# Altium project BMS_BQ76PL455.PrjPcb
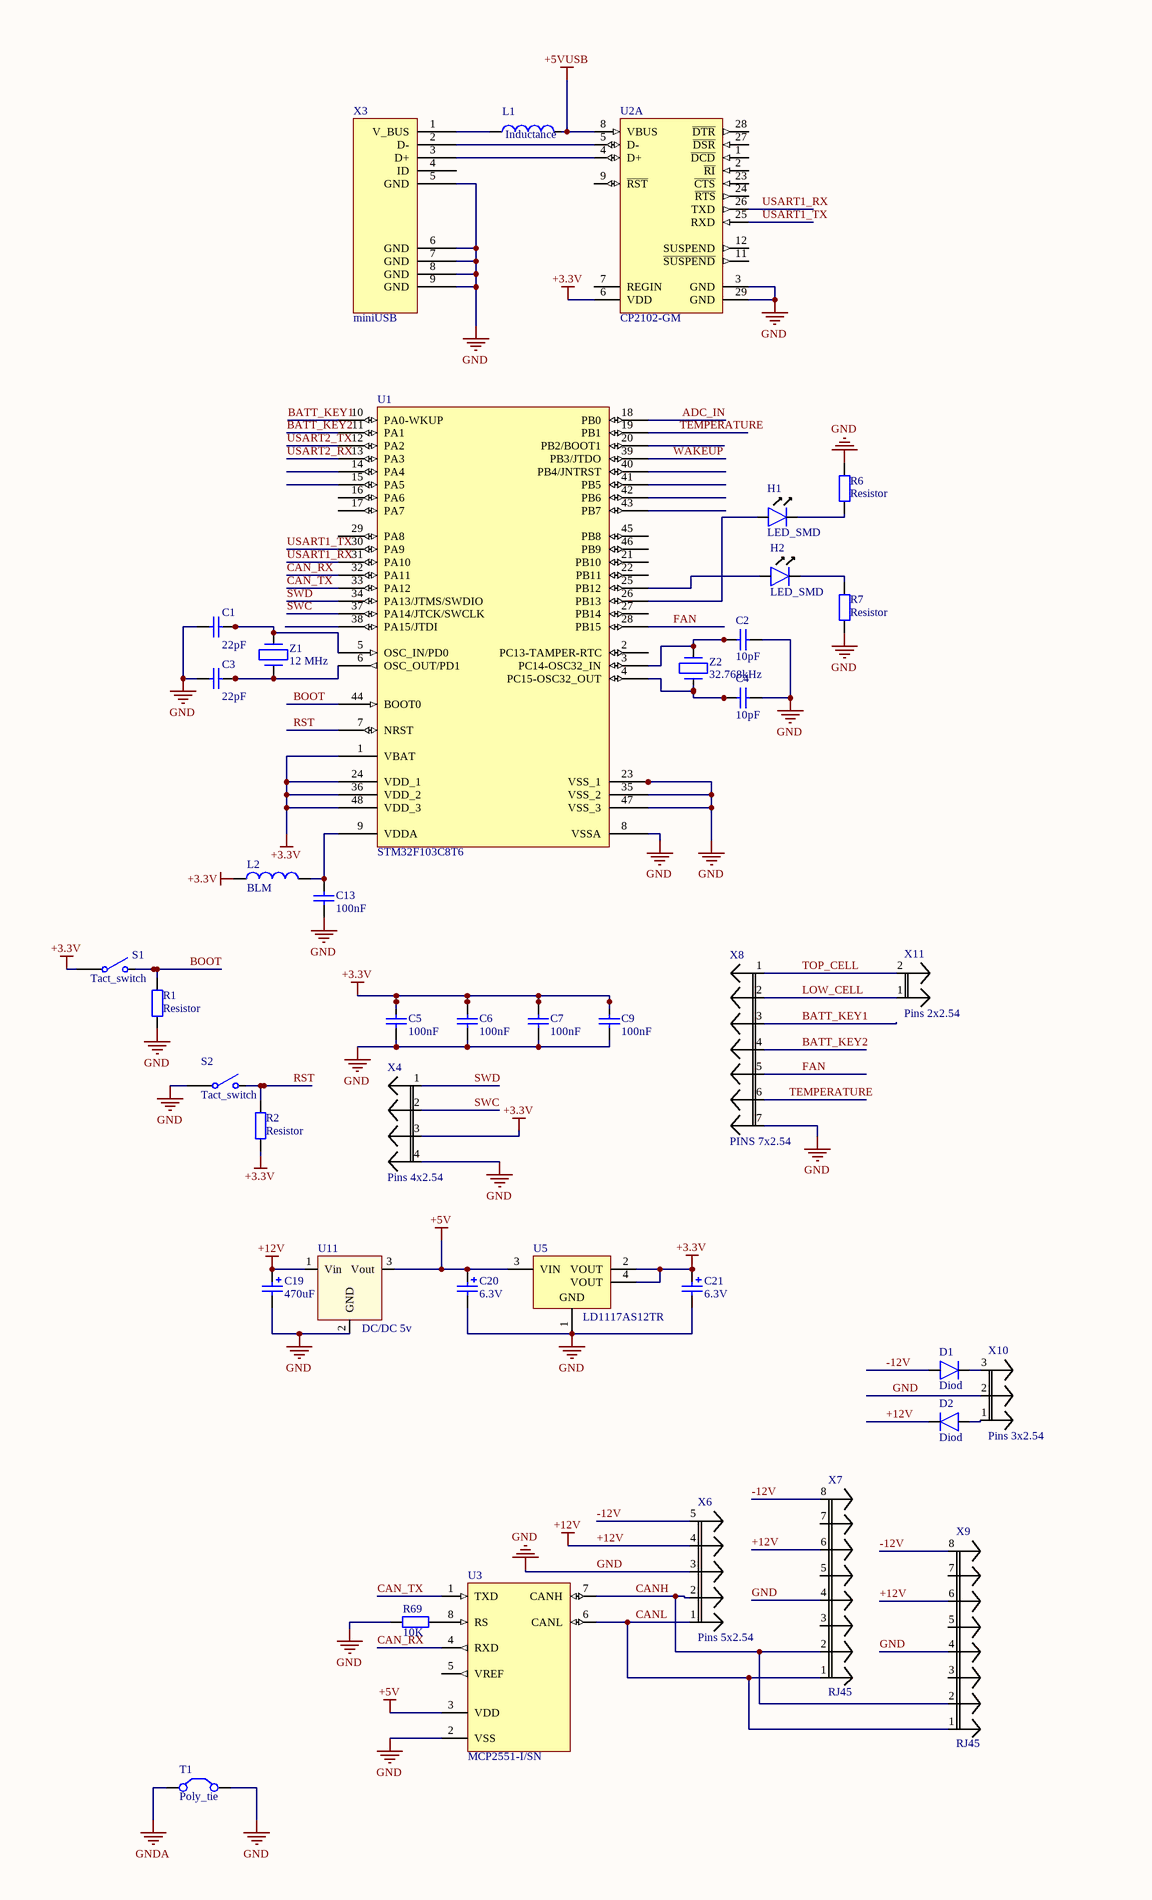
[diagram p0: BMS_BQ76PL455.SchDoc, left]
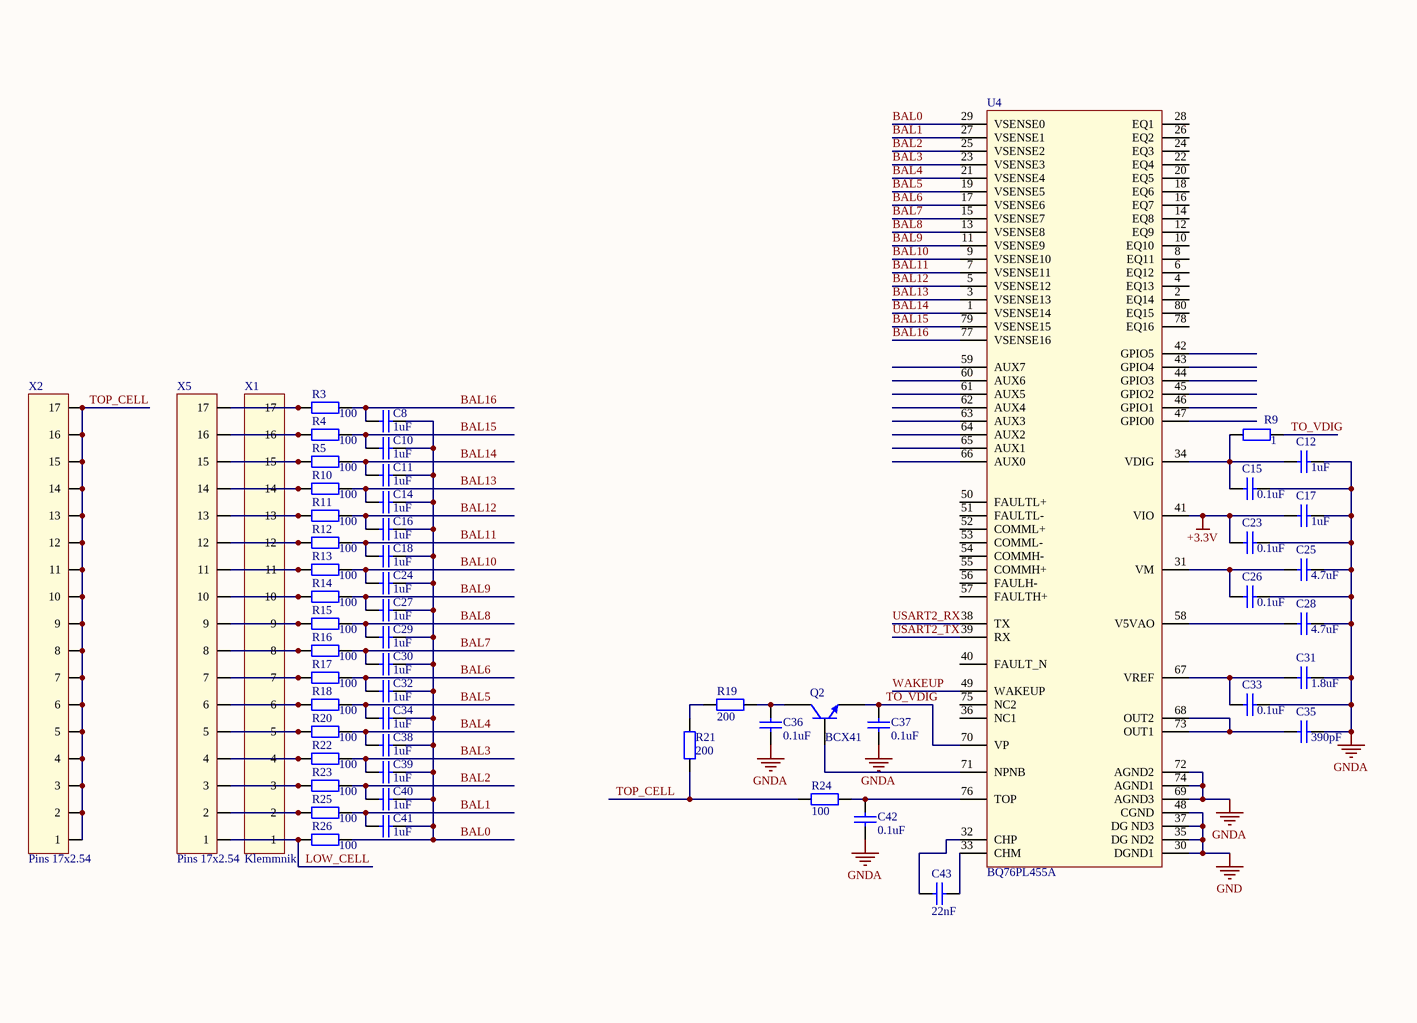
[diagram p1: BMS_BQ76PL455.SchDoc, right]
1 sheet, 97 parts. Net scope: global (net labels, ports and power ports of the same name join across sheets).
Board file: BMS_BQ76PL455.PcbDoc

## Sheet BMS_BQ76PL455.SchDoc
size A1

### Parts
C1  22pF  [C0805]
C2  10pF  [C0805]
C3  22pF  [C0805]
C4  10pF  [C0805]
C5  100nF  [C0805]
C6  100nF  [C0805]
C7  100nF  [C0805]
C8  1uF  [C0805]
C9  100nF  [C0805]
C10  1uF  [C0805]
C11  1uF  [C0805]
C12  1uF  [C0805]
C13  100nF  [C0805]
C14  1uF  [C0805]
C15  0.1uF  [C0805]
C16  1uF  [C0805]
C17  1uF  [C0805]
C18  1uF  [C0805]
C19  470uF  [Cap_El_SMD_10mm]
C20  6.3V  [CAP_EL_SMD_6.3mm]
C21  6.3V  [CAP_EL_SMD_6.3mm]
C23  0.1uF  [C0805]
C24  1uF  [C0805]
C25  4.7uF  [C0805]
C26  0.1uF  [C0805]
C27  1uF  [C0805]
C28  4.7uF  [C0805]
C29  1uF  [C0805]
C30  1uF  [C0805]
C31  1.8uF  [C0805]
C32  1uF  [C0805]
C33  0.1uF  [C0805]
C34  1uF  [C0805]
C35  390pF  [C0805]
C36  0.1uF  [C0805]
C37  0.1uF  [C0805]
C38  1uF  [C0805]
C39  1uF  [C0805]
C40  1uF  [C0805]
C41  1uF  [C0805]
C42  0.1uF  [C0805]
C43  22nF  [C0805]
D1  Diod  [SMB_DIODE]
D2  Diod  [SMB_DIODE]
H1  LED_SMD  [C0805]
H2  LED_SMD  [C0805]
L1  Inductance  [L0805]
L2  BLM  [L0805]
Q2  BCX41  [SOT-23A_N]
R1  Resistor  [R0805]
R2  Resistor  [R0805]
R3  100  [R0805]
R4  100  [R0805]
R5  100  [R0805]
R6  Resistor  [R0805]
R7  Resistor  [R0805]
R9  1  [R0805]
R10  100  [R0805]
R11  100  [R0805]
R12  100  [R0805]
R13  100  [R0805]
R14  100  [R0805]
R15  100  [R0805]
R16  100  [R0805]
R17  100  [R0805]
R18  100  [R0805]
R19  200  [R0805]
R20  100  [R0805]
R21  200  [R0805]
R22  100  [R0805]
R23  100  [R0805]
R24  100  [R0805]
R25  100  [R0805]
R26  100  [R0805]
R69  10K  [R0805]
S1  Tact_switch  [Tact_switch_smd]
S2  Tact_switch  [Tact_switch_smd]
T1  Poly_tie  [POLY_TIE_1x2]
U1  STM32F103C8T6  [LQFP48_N]
U2  CP2102-GM  [SLAB-QFN-28-3125x3125TP_N]  (part A of 2)
U3  MCP2551-I/SN  [SOIC-SN8_N]
U4  BQ76PL455A  [TQFP80 50P1400X1400X120-80N]
U5  LD1117AS12TR  [SOT-223_N]
U11  DC/DC 5v  [DC/DC R-78E]
X1  Klemmnik  [Klemm 17]
X2  Pins 17x2.54  [Pins 17x2 2.54]
X3  miniUSB  [miniUSB]
X4  Pins 4x2.54  [Pins 4x2.54]
X5  Pins 17x2.54  [Pins 17x2 2.54]
X6  Pins 5x2.54  [Pins 5x2.54]
X7  RJ45  [RJ45]
X8  PINS 7x2.54  [PINS 7X2.54]
X9  RJ45  [RJ45]
X10  Pins 3x2.54  [Pins 3x2.54]
X11  Pins 2x2.54  [Pins 2x2.54]
Z1  12 MHz  [kx 13 12MHz]
Z2  32.768kHz  [Geyer KX - 327S 32.768kHz]

### Nets
+3.3V: C5.2 C6.2 C7.2 C9.2 C17.1 C21.1 C23.1 L2.1 R2.1 S1.1(COMMON) U1.1(VBAT) U1.24(VDD_1) U1.36(VDD_2) U1.48(VDD_3) U2.6(VDD) U4.41(VIO) U5.2(VOUT) U5.4(VOUT) X4.3
+5V: C20.1 U3.3(VDD) U5.3(VIN) U11.3(Vout)
+5VUSB: L1.2 U2.8(VBUS)
+12V: C19.1 D2.2 U11.1(Vin) X6.4 X7.6 X9.6
GND: C1.1 C2.1 C3.1 C4.1 C5.1 C6.1 C7.1 C9.1 C13.1 C19.2 C20.2 C21.2 R1.1 R6.2 R7.1 R69.2 S2.1(COMMON) T1.2(C2) U1.8(VSSA) U1.23(VSS_1) U1.35(VSS_2) U1.47(VSS_3) U2.3(GND) U2.29(GND) U3.2(VSS) U4.30(DGND1) U4.35(DG_ND2) U4.37(DG_ND3) U4.48(CGND) U5.1(GND) U11.2(GND) X3.5(GND) X3.6(GND) X3.7(GND) X3.8(GND) X3.9(GND) X4.4 X6.3 X7.4 X8.7 X9.4 X10.2
GNDA: C12.2 C15.2 C17.2 C23.2 C25.2 C26.2 C28.2 C31.2 C33.2 C35.2 C36.1 C37.1 C42.1 T1.1(C1) U4.69(AGND3) U4.72(AGND2) U4.74(AGND1)
-12V: D1.1 X6.5 X7.8 X9.8
ADC_IN: U1.18(PB0)
BAL0: C8.2 C10.2 C11.2 C14.2 C16.2 C18.2 C24.2 C27.2 C29.2 C30.2 C32.2 C34.2 C38.2 C39.2 C40.2 C41.2 R26.1 U4.29(VSENSE0)
BAL1: C41.1 R25.1 U4.27(VSENSE1)
BAL2: C40.1 R23.1 U4.25(VSENSE2)
BAL3: C39.1 R22.1 U4.23(VSENSE3)
BAL4: C38.1 R20.1 U4.21(VSENSE4)
BAL5: C34.1 R18.1 U4.19(VSENSE5)
BAL6: C32.1 R17.1 U4.17(VSENSE6)
BAL7: C30.1 R16.1 U4.15(VSENSE7)
BAL8: C29.1 R15.1 U4.13(VSENSE8)
BAL9: C27.1 R14.1 U4.11(VSENSE9)
BAL10: C24.1 R13.1 U4.9(VSENSE10)
BAL11: C18.1 R12.1 U4.7(VSENSE11)
BAL12: C16.1 R11.1 U4.5(VSENSE12)
BAL13: C14.1 R10.1 U4.3(VSENSE13)
BAL14: C11.1 R5.1 U4.1(VSENSE14)
BAL15: C10.1 R4.1 U4.79(VSENSE15)
BAL16: C8.1 R3.1 U4.77(VSENSE16)
BATT_KEY1: U1.10(PA0-WKUP) X8.3
BATT_KEY2: U1.11(PA1) X8.4
BOOT: R1.2 S1.2(NO) U1.44(BOOT0)
CAN_RX: U1.32(PA11) U3.4(RXD)
CAN_TX: U1.33(PA12) U3.1(TXD)
CANH: U3.7(CANH) X6.2 X7.2 X9.2
CANL: U3.6(CANL) X6.1 X7.1 X9.1
FAN: U1.28(PB15) X8.5
LOW_CELL: R26.2 X1.1 X5.1 X8.2 X11.1
RST: R2.2 S2.2(NO) U1.7(NRST)
SWC: U1.37(PA14/JTCK/SWCLK) X4.2
SWD: U1.34(PA13/JTMS/SWDIO) X4.1
TEMPERATURE: U1.19(PB1) X8.6
TO_VDIG: C37.2 Q2.2(E) R9.1 U4.70(VP)
TOP_CELL: R21.2 R24.2 X2.1 X2.2 X2.3 X2.4 X2.5 X2.6 X2.7 X2.8 X2.9 X2.10 X2.11 X2.12 X2.13 X2.14 X2.15 X2.16 X2.17 X8.1 X11.2
USART1_RX: U1.31(PA10) U2.26(TXD)
USART1_TX: U1.30(PA9) U2.25(RXD)
USART2_RX: U1.13(PA3) U4.38(TX)
USART2_TX: U1.12(PA2) U4.39(RX)
WAKEUP: U1.39(PB3/JTDO) U4.49(WAKEUP)
NetC1_2: C1.2 U1.5(OSC_IN/PD0) Z1.1
NetC2_2: C2.2 U1.3(PC14-OSC32_IN) Z2.1
NetC3_2: C3.2 U1.6(OSC_OUT/PD1) Z1.3
NetC4_2: C4.2 U1.4(PC15-OSC32_OUT) Z2.2
NetC12_1: C12.1 C15.1 R9.2 U4.34(VDIG)
NetC13_2: C13.2 L2.2 U1.9(VDDA)
NetC25_1: C25.1 C26.1 U4.31(VM)
NetC28_1: C28.1 U4.58(V5VAO)
NetC31_1: C31.1 C33.1 U4.67(VREF)
NetC35_1: C35.1 U4.68(OUT2) U4.73(OUT1)
NetC36_2: C36.2 Q2.3(C) R19.1
NetC42_2: C42.2 R24.1 U4.76(TOP)
NetC43_1: C43.1 U4.32(CHP)
NetC43_2: C43.2 U4.33(CHM)
NetD1_2: D1.2 X10.3
NetD2_1: D2.1 X10.1
NetH1_1: H1.1 U1.26(PB13)
NetH1_2: H1.2 R6.1
NetH2_1: H2.1 U1.25(PB12)
NetH2_2: H2.2 R7.2
NetL1_1: L1.1 X3.1(V_BUS)
NetQ2_1: Q2.1(B) U4.71(NPNB)
NetR3_2: R3.2 X1.17 X5.17
NetR4_2: R4.2 X1.16 X5.16
NetR5_2: R5.2 X1.15 X5.15
NetR10_2: R10.2 X1.14 X5.14
NetR11_2: R11.2 X1.13 X5.13
NetR12_2: R12.2 X1.12 X5.12
NetR13_2: R13.2 X1.11 X5.11
NetR14_2: R14.2 X1.10 X5.10
NetR15_2: R15.2 X1.9 X5.9
NetR16_2: R16.2 X1.8 X5.8
NetR17_2: R17.2 X1.7 X5.7
NetR18_2: R18.2 X1.6 X5.6
NetR19_2: R19.2 R21.1
NetR20_2: R20.2 X1.5 X5.5
NetR22_2: R22.2 X1.4 X5.4
NetR23_2: R23.2 X1.3 X5.3
NetR25_2: R25.2 X1.2 X5.2
NetR69_1: R69.1 U3.8(RS)
NetU2_4: U2.4(D+) X3.3(D+)
NetU2_5: U2.5(D-) X3.2(D-)

Not connected (* = marked no-connect by the designer): U1 2(PC13-TAMPER-RTC) 14(PA4) 15(PA5) 16(PA6) 17(PA7) 20(PB2/BOOT1) 21(PB10) 22(PB11) 27(PB14) 29(PA8) 38(PA15/JTDI) 40(PB4/JNTRST) 41(PB5) 42(PB6) 43(PB7) 45(PB8) 46(PB9); U2 1(~{DCD}) 2(~{RI}) 7(REGIN) 9(~{RST}) 11(~{SUSPEND}) 12(SUSPEND) 23(~{CTS}) 24(~{RTS}) 27(~{DSR}) 28(~{DTR}); U3 5(VREF); U4 2(EQ14) 4(EQ13) 6(EQ12) 8(EQ11) 10(EQ10) 12(EQ9) 14(EQ8) 16(EQ7) 18(EQ6) 20(EQ5) 22(EQ4) 24(EQ3) 26(EQ2) 28(EQ1) 36(NC1) 40(FAULT_N) 42(GPIO5) 43(GPIO4) 44(GPIO3) 45(GPIO2) 46(GPIO1) 47(GPIO0) 50(FAULTL+) 51(FAULTL-) 52(COMML+) 53(COMML-) 54(COMMH-) 55(COMMH+) 56(FAULH-) 57(FAULTH+) 59(AUX7) 60(AUX6) 61(AUX5) 62(AUX4) 63(AUX3) 64(AUX2) 65(AUX1) 66(AUX0) 75(NC2) 78(EQ16) 80(EQ15); X3 4(ID); X7 3 5 7; X9 3 5 7

### Library data of the parts
C1-C18 C23-C43 = Condensator
C19-C21 = Cond_polar
L2 = Inductance
Q2 = BC817-25: NPN General Purpose Amplifier; Published: 8-Jun-2000; LatestRevisionDate: 20-Nov-2009; LatestRevisionNote: IPC-7351 Footprint Added.; DatasheetVersion: 1997; PackageVersion: Sep-1998; PackageReference: SOT-23A; Publisher: Altium Limited; PackageDescription: 3-Pin SOT-23 Package 0.95 mm Pitch, 2.3 mm Lead Span; ComponentLink1Description: Manufacturer Link; ComponentLink1URL: http://www.fairchildsemi.com/; ComponentLink2Description: Discontinuation Notice; ComponentLink2URL: http://www.fairchildsemi.com/obsolete/obs.jsp
R3-R5 R9-R26 R69 = Resistor
U1 = STM32F103C8T6: STM32 ARM-based 32-bit MCU with 64 Kbytes Flash, 48-pin LQFP, Industrial Temperature; Published: 30-May-2008; DatasheetVersion: rev6, Mar-2008; PackageVersion: Mar-2008; PackageReference: LQFP48; Publisher: Altium Limited; PackageDescription: 48-Pin Low-Profile Quad Flat Pack, 7 x 7 mm Body, 0.5 mm Pitch (LQFP48); ComponentLink1Description: Manufacturer Link; ComponentLink1URL: www.st.com/stm32; ComponentLink2Description: Datasheet; ComponentLink2URL: http://www.st.com/stonline/products/literature/ds/13587.pdf
U2 = CP2102-GM: Single-Chip USB to UART Bridge, 1024 Bytes EEPROM, -40 to 85 degC, 28-pin QFN, Tube; Manufacturer: Silicon Labs; Internal Oscillator: TRUE; Sub-Family: USB Bridges; DatasheetVersion: Rev. 1.5; PackageReference: QFN-28; PackageDescription: 28-Pin Quad-Flat No-Leads Package, Body 5 x 5 mm, Pitch 0.5 mm; Supplier 1: Digi-Key; Supplier Part Number 1: 336-1160-5-ND; Supplier 2: Farnell; Supplier Part Number 2: 9282130; Supplier 3: Newark; Supplier Part Number 3: 30K5635; Supplier 4: Mouser; Supplier Part Number 4: 634-CP2102-GM; EEPROM: 1024 Bytes; Mounting Technology: Surface Mount; Code_JEDEC: MO-220; Code_IPC: J-STD-020C; PartNumber: CP2102-GM; ComponentLink1Description: Manufacturer URL; ComponentLink1URL: http://www.silabs.com/; ComponentLink2Description: Datasheet; ComponentLink2URL: http://www.silabs.com/Support%20Documents/TechnicalDocs/CP2102-9.pdf; ComponentLink3Description: Package Specification; ComponentLink3URL: http://www.silabs.com/Support%20Documents/TechnicalDocs/C8051T61x.pdf
U3 = MCP2551-I/SN: High-Speed CAN Transceiver, 8-Pin SOIC, Industrial Temperature; Published: 29-Jan-2009; DatasheetVersion: revE, Jan-2007; PackageVersion: revBB, Aug-2009; PackageReference: SOIC-SN8; Publisher: Altium Limited; PackageDescription: 8-Lead Plastic Small Outline (SN) - Narrow, 3.90mm Body [SOIC]; Supplier 1: Digi-Key; Supplier Part Number 1: MCP2551-I/SN-ND; Supplier 2: Farnell; Supplier Part Number 2: 9758569; Code_JEDEC: MS-012; Code_IPC: SOIC127P600-8; ComponentLink1Description: Datasheet; ComponentLink1URL: http://ww1.microchip.com/downloads/en/DeviceDoc/21667E.pdf; ComponentLink2Description: Packaging Specification; ComponentLink2URL: http://www.microchip.com/stellent/groups/techpub_sg/documents/packagingspec/en012702.pdf; ComponentLink3Description: Microchip.com Home; ComponentLink3URL: http://www.microchip.com/
U4 = BQ76PL455A: 16-Cell Industrial Integrated Battery Monitor with Passive Cell Balancing
U5 = LD1117AS12TR: 1A, Low Drop Positive Voltage Regulator, 1.2V, 4-Pin SOT-223, Tape and Reel; DatasheetVersion: Dec-2011; PackageVersion: 2010; PackageReference: SOT-223; PackageDescription: 4-Pin SOT-223 Package, 6.5 x 3.5 mm Body, 2.3 mm Pitch, 7 mm Lead Span; PartNumber: LD1117AS12TR; ComponentLink1Description: Manufacturer URL; ComponentLink1URL: http://www.st.com; ComponentLink2Description: Datasheet; ComponentLink2URL: http://www.st.com/internet/com/TECHNICAL_RESOURCES/TECHNICAL_LITERATURE/DATASHEET/CD00002116.pdf
U11 = DC/DC R-78E
X1 = Klemm 17
Z1 = KX 13 Geyer
Z2 = Crystal Oscillator